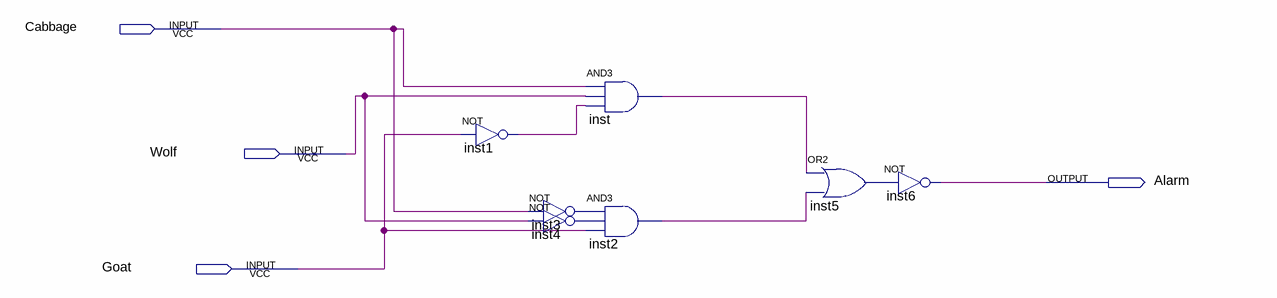
[diagram p0: schematic sheet]
// Quartus schematic lab2step2.bdf as structural Verilog: 7 symbols, 4 pins
module lab2step2 (
  input  Cabbage,
  input  Wolf,
  input  Goat,
  output Alarm
);

  wire inst1_out, inst2_out, inst3_out, inst4_out, inst5_out, inst_out;

  not inst1 (inst1_out, Goat);
  not inst3 (inst3_out, Cabbage);
  not inst4 (inst4_out, Wolf);
  and inst (inst_out, Cabbage, Wolf, inst1_out);
  and inst2 (inst2_out, inst3_out, inst4_out, Goat);
  or inst5 (inst5_out, inst_out, inst2_out);
  not inst6 (Alarm, inst5_out);
endmodule
